# Altium schematic sheet TSAL_Logic.SchDoc
size A4; SheetNumber: 1; SheetTotal: 1
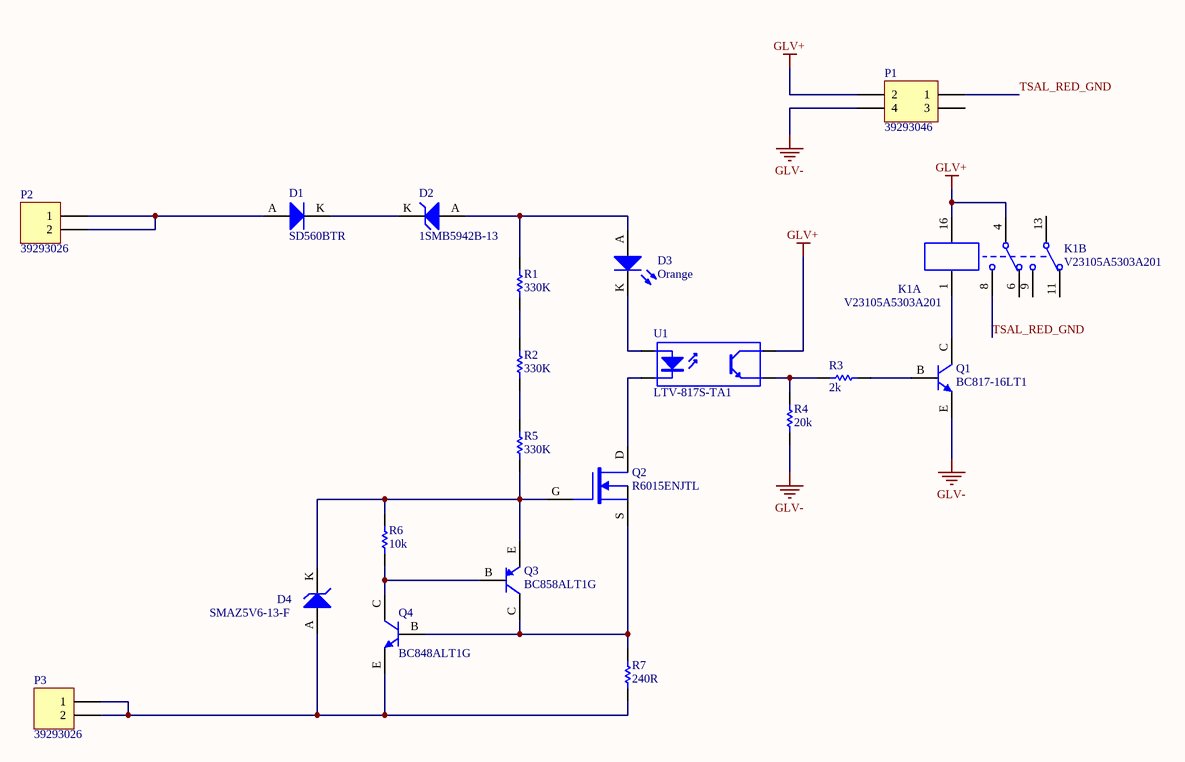
[diagram p0: TSAL_Logic.SchDoc]

## Parts
D1  SD560BTR  [SMB Diode]
D2  1SMB5942B-13  [DI SMB Diode]
D3  Orange  [0805 LED]
D4  SMAZ5V6-13-F  [DI SMA Diode]
K1  V23105A5303A201  [TI 2-DIL]  (parts A,B of 2)
P1  39293046  [39293046]
P2  39293026  [39293026]
P3  39293026  [39293026]
Q1  BC817-16LT1  [ON SOT-23 BJT]
Q2  R6015ENJTL  [R TO-263 N-MOSFET]
Q3  BC858ALT1G  [ON TO-236-3 BJT]
Q4  BC848ALT1G  [ON TO-236-3 BJT]
R1  330K  [VB 0204]
R2  330K  [VB 0204]
R3  2k  [0805]
R4  20k  [0805]
R5  330K  [VB 0204]
R6  10k  [0805]
R7  240R  [0805]
U1  LTV-817S-TA1  [ON 4-SMD]

## Nets
GLV+: K1.4 K1.16 P1.2 U1.4(C)
GLV-: P1.4 Q1.E R4.1
TSAL_RED_GND: K1.8 P1.1
NetD1_A: D1.A P2.1 P2.2
NetD1_K: D1.K D2.K
NetD2_A: D2.A D3.A R1.2
NetD3_K: D3.K U1.1(A)
NetD4_A: D4.A P3.1 P3.2 Q4.E R7.1
NetD4_K: D4.K Q2.G Q3.E R5.1 R6.2
NetK1_1: K1.1 Q1.C
NetQ1_B: Q1.B R3.2
NetQ2_D: Q2.D U1.2(K)
NetQ2_S: Q2.S Q3.C Q4.B R7.2
NetQ3_B: Q3.B Q4.C R6.1
NetR1_1: R1.1 R2.2
NetR2_1: R2.1 R5.2
NetR3_1: R3.1 R4.2 U1.3(E)

Not connected (* = marked no-connect by the designer): K1 6 9 11 13; P1 3

## Library data of the parts
D1 = SD560BTR: 1.2V_F 600V 5A SMB; Manufacturer: SMC Diode Solutions; Part Number: SD560BTR; Digikey Part Number: 1655-1530-2-ND; Digikey Link: https://www.digikey.com/product-detail/en/smc-diode-solutions/SD560BTR/1655-1530-2-ND/6022620
D2 = 1SMB5942B-13: DIODE ZENER 51V 3W SMB; Manufacturer: Diodes Inc; Part Number: 1SMB5942B-13; Digikey Part Number: 1SMB5942B-13DICT-ND; Digikey Link: https://www.digikey.com/product-detail/en/diodes-incorporated/1SMB5942B-13/1SMB5942B-13DICT-ND/5054245
D3 = SML-211DTT86: Orange LED Indication - Discrete 1.75V 0805 (2012 Metric); Manufacturer: ROHM Semiconductor; Part Number: SML-211DTT86; Colour: Orange; Digikey Part Number: 511-1291-1-ND; Digikey Link: https://www.digikey.com/product-detail/en/rohm-semiconductor/SML-211DTT86/511-1291-1-ND/637104
D4 = SMAZ5V6-13-F: DIODE ZENER 5.6V 1W SMA; Manufacturer: Diodes Inc; Part Number: SMAZ5V6-13-F; Digikey Part Number: SMAZ5V6-FDICT-ND; Digikey Link: https://www.digikey.com/product-detail/en/diodes-incorporated/SMAZ5V6-13-F/SMAZ5V6-FDICT-ND/755500
K1 = V23105A5303A201: RELAY TELECOM DPDT 3A 12V; Manufacturer: TE Connectivity; Part Number: V23105A5303A201; Digikey Part Number: PB387-ND; Digikey Link: https://www.digikey.com/product-detail/en/te-connectivity-potter-brumfield-relays/V23105A5303A201/PB387-ND/291023
P1 = 39293046: Pitch: 4.2mm; Row Spacing: 5.5mm; Angle: 0; Flange: No; Contact: Tin; Part Number: 39293046; Positions: 4; Digikey Part Number: WM3844-ND
P2 P3 = 39293026: Pitch: 4.2mm; Row Spacing: 5.5mm; Angle: 0; Flange: No; Contact: Tin; Part Number: 39293026; Positions: 2; Digikey Part Number: WM3843-ND
Q1 = BC817-16LT1: 300mW  BJT NPN Transistor; Manufacturer: ON Semiconductor; Part Number: BC817-16LT1; Digikey Part Number: BC817-16LT1OSTR-ND; Digikey Link: https://www.digikey.com.au/product-detail/en/on-semiconductor/BC817-16LT1/BC817-16LT1OSTR-ND/606178
Q2 = R6015ENJTL: MOSFET N-CH 600V 15A LPT; Manufacturer: Rohm Semiconductor; Published: 24-Mar-1999; LatestRevisionDate: 29-May-2009; LatestRevisionNote: IPC-7351 Footprint Added.; PackageVersion: Sep-2000; PackageReference: SOT-343; Publisher: Altium Limited; PackageDescription: 4-Pin SOT-343 Package 1.3 mm Pitch, 2.1 mm Lead Span; Part Number: R6015ENJTL; Digikey Part Number: R6015ENJTLCT-ND; Digikey Link: https://www.digikey.com.au/product-detail/en/rohm-semiconductor/R6015ENJTL/R6015ENJTLCT-ND/5042516
Q3 = BC858ALT1G: TRANS PNP 30V 0.1A SOT-23; Manufacturer: ON Semiconductor; Part Number: BC858ALT1G; Digikey Part Number: BC858ALT1GOSCT-ND; Digikey Link: https://www.digikey.com.au/product-detail/en/on-semiconductor/BC858ALT1G/BC858ALT1GOSCT-ND/3462248?fbclid=IwAR0XE0JmsZu1bfxkpmh7_fMKeVVYT41RbargOB6Kv0hZlYRUvP_HzrN_yXU
Q4 = BC848ALT1G: TRANS NPN 30V 0.1A SOT23; Manufacturer: ON Semiconductor; Part Number: BC848ALT1G; Digikey Part Number: BC848ALT1GOSCT-ND; Digikey Link: https://www.digikey.com/product-detail/en/on-semiconductor/BC848ALT1G/BC848ALT1GOSCT-ND/917837
R1 R2 R5 = MMA02040C3303FB300: Manufacturer: Vishay Beyschlag; Tolerance: 0.01; Rated Voltage: 0.4W; Part Number: MMA02040C3303FB300; Value: 330K; Digikey Part Number: MMA-330KACT-ND
R3 = RC0805FR072KL: Manufacturer: YAGEO; Tolerance: 0.01; Rated Voltage: 0.125W; Part Number: RC0805FR072KL; Value: 2k; Material: FR-07; Digikey Part Number: 311-2.00KCRCT-ND
R4 = RC0805FR0720KL: Manufacturer: YAGEO; Tolerance: 0.01; Rated Voltage: 0.125W; Part Number: RC0805FR0720KL; Value: 20k; Material: FR-07; Digikey Part Number: 311-20.0KCRCT-ND
R6 = RC0805FR0710KL: Manufacturer: YAGEO; Tolerance: 0.01; Rated Voltage: 0.125W; Part Number: RC0805FR0710KL; Value: 10k; Material: FR-07; Digikey Part Number: 311-10.0KCRCT-ND
R7 = RC0805FR07240RL: Manufacturer: YAGEO; Tolerance: 0.01; Rated Voltage: 0.125W; Part Number: RC0805FR07240RL; Value: 240R; Material: FR-07; Digikey Part Number: 311-240CRCT-ND
U1 = LTV-817S-TA1: 35V 50ma Optocoupler (VF=1.2V); Manufacturer: Lite-On Inc; Part Number: LTV-817S-TA1; Digikey Part Number: 160-1893-2-ND; Digikey Link: https://www.digikey.com/product-detail/en/lite-on-inc/LTV-817S-TA1/160-1893-2-ND/388451